# Altium schematic sheet Motor driver.SchDoc
size A4
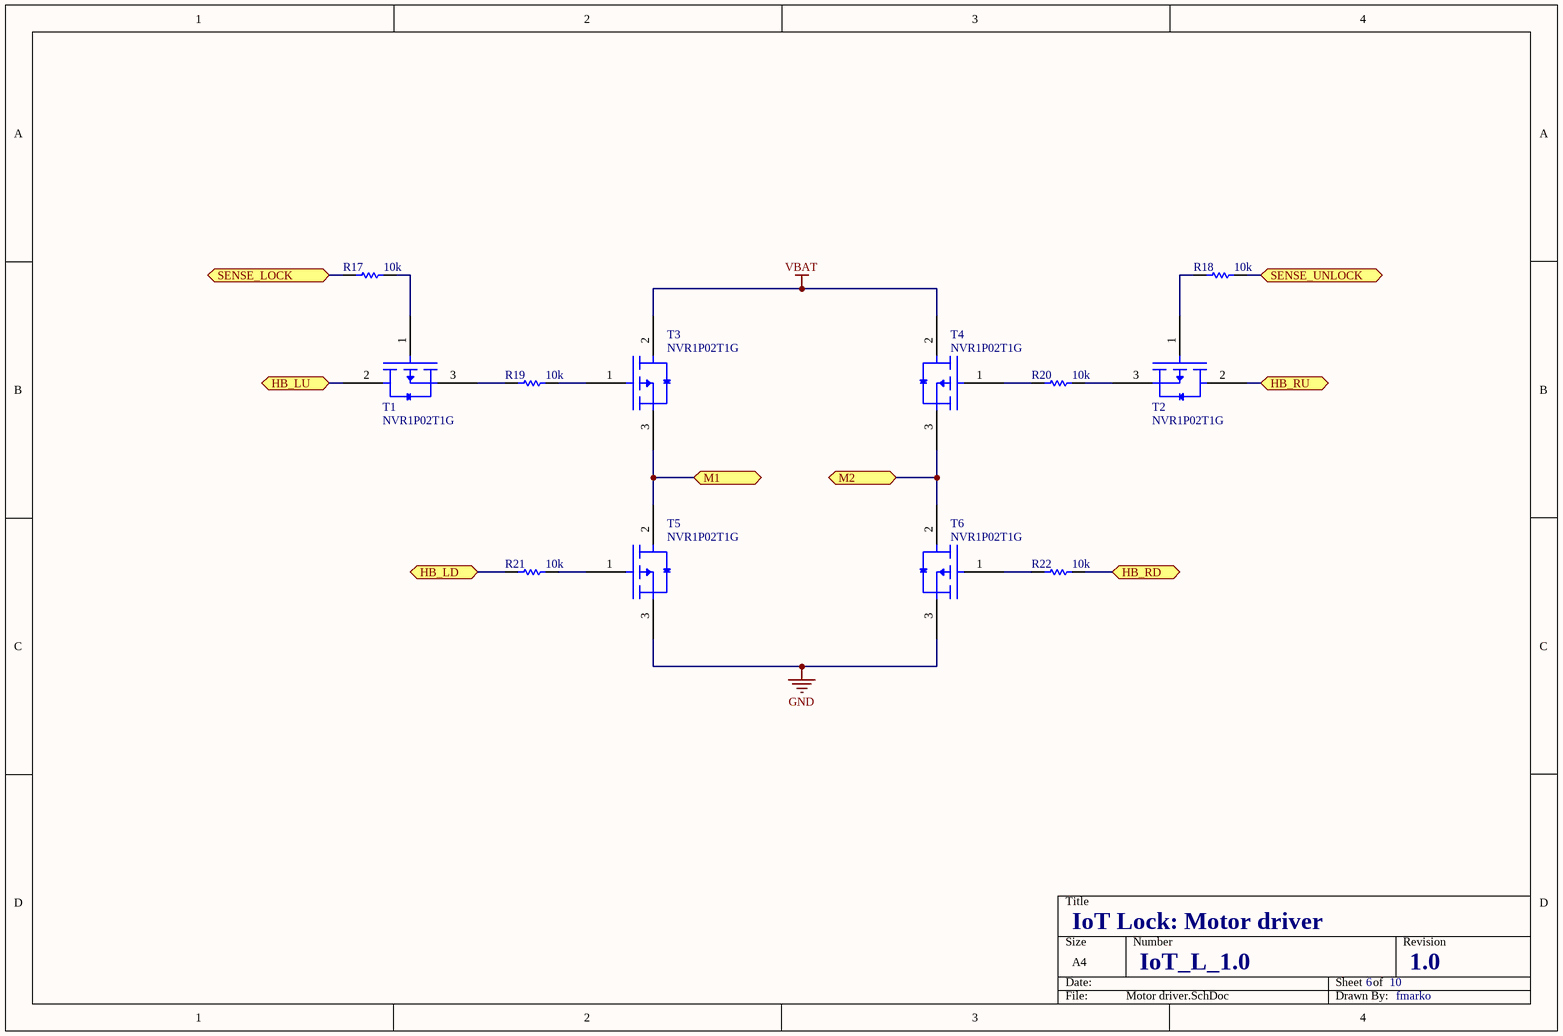
[diagram p0: Motor driver.SchDoc]

## Parts
R17  value 10k  [0402]  (hidden comment: Res Semi)
R18  value 10k  [0402]  (hidden comment: Res Semi)
R19  value 10k  [0402]  (hidden comment: Res Semi)
R20  value 10k  [0402]  (hidden comment: Res Semi)
R21  value 10k  [0402]  (hidden comment: Res Semi)
R22  value 10k  [0402]  (hidden comment: Res Semi)
T1  NVR1P02T1G  [SOT95P237X111-3N]
T2  NVR1P02T1G  [SOT95P237X111-3N]
T3  NVR1P02T1G  [SOT95P237X111-3N]
T4  NVR1P02T1G  [SOT95P237X111-3N]
T5  NVR1P02T1G  [SOT95P237X111-3N]
T6  NVR1P02T1G  [SOT95P237X111-3N]

## Ports
HB_LD, HB_LU, HB_RD, HB_RU, M1, M2, SENSE_LOCK, SENSE_UNLOCK

## Nets
GND: T5.3(D) T6.3(D)
VBAT: T3.2(S) T4.2(S)
HB_LD: R21.1 ; port HB_LD
HB_LU: T1.2(S) ; port HB_LU
HB_RD: R22.2 ; port HB_RD
HB_RU: T2.2(S) ; port HB_RU
M1: T3.3(D) T5.2(S) ; port M1
M2: T4.3(D) T6.2(S) ; port M2
SENSE_LOCK: R17.1 ; port SENSE_LOCK
SENSE_UNLOCK: R18.2 ; port SENSE_UNLOCK
NetR17_2: R17.2 T1.1(G)
NetR18_1: R18.1 T2.1(G)
NetR19_1: R19.1 T1.3(D)
NetR19_2: R19.2 T3.1(G)
NetR20_1: R20.1 T4.1(G)
NetR20_2: R20.2 T2.3(D)
NetR21_2: R21.2 T5.1(G)
NetR22_1: R22.1 T6.1(G)

## Notes on the sheet
- IoT Lock: Motor driver
- IoT_L_1.0
- 6
- 10
- 1.0
- fmarko

## Library data of the parts
R17-R22 = Res Semi: Semiconductor Resistor; Published: 8-Jun-2000; LatestRevisionDate: 17-Jul-2002; LatestRevisionNote: Re-released for DXP Platform.; PackageReference: AXIAL-0.5; Publisher: Altium Limited; PackageDescription: Axial Device, Thru-Hole; 2 Leads; 0.5 in Pin Spacing
T1-T6 = NVR1P02T1G: P-Channel MOSFET